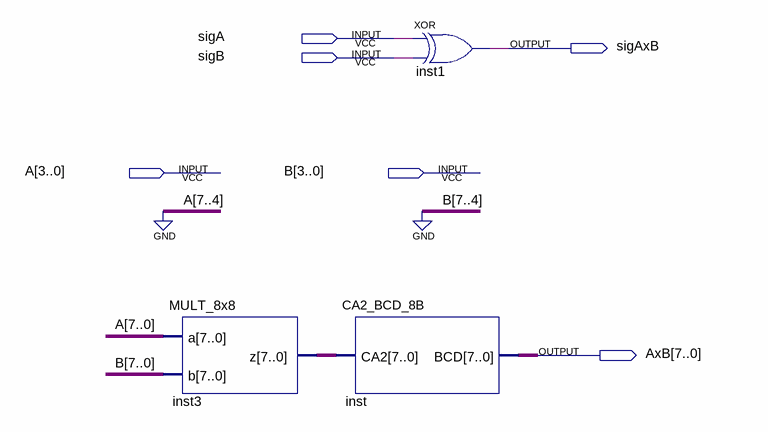
[diagram p0: schematic sheet]
// Quartus schematic AperB.bdf as structural Verilog: 3 symbols, 6 pins
module AperB (
  input  sigA,
  input  sigB,
  input  [3:0] A,
  input  [3:0] B,
  output sigAxB,
  output [7:0] AxB
);

  wire [7:0] inst3_z;

  MULT_8x8 inst3 (.a({4'b0000, A}), .b({4'b0000, B}), .z(inst3_z));
  CA2_BCD_8B inst (.CA2(inst3_z), .BCD(AxB));
  xor inst1 (sigAxB, sigA, sigB);
endmodule
